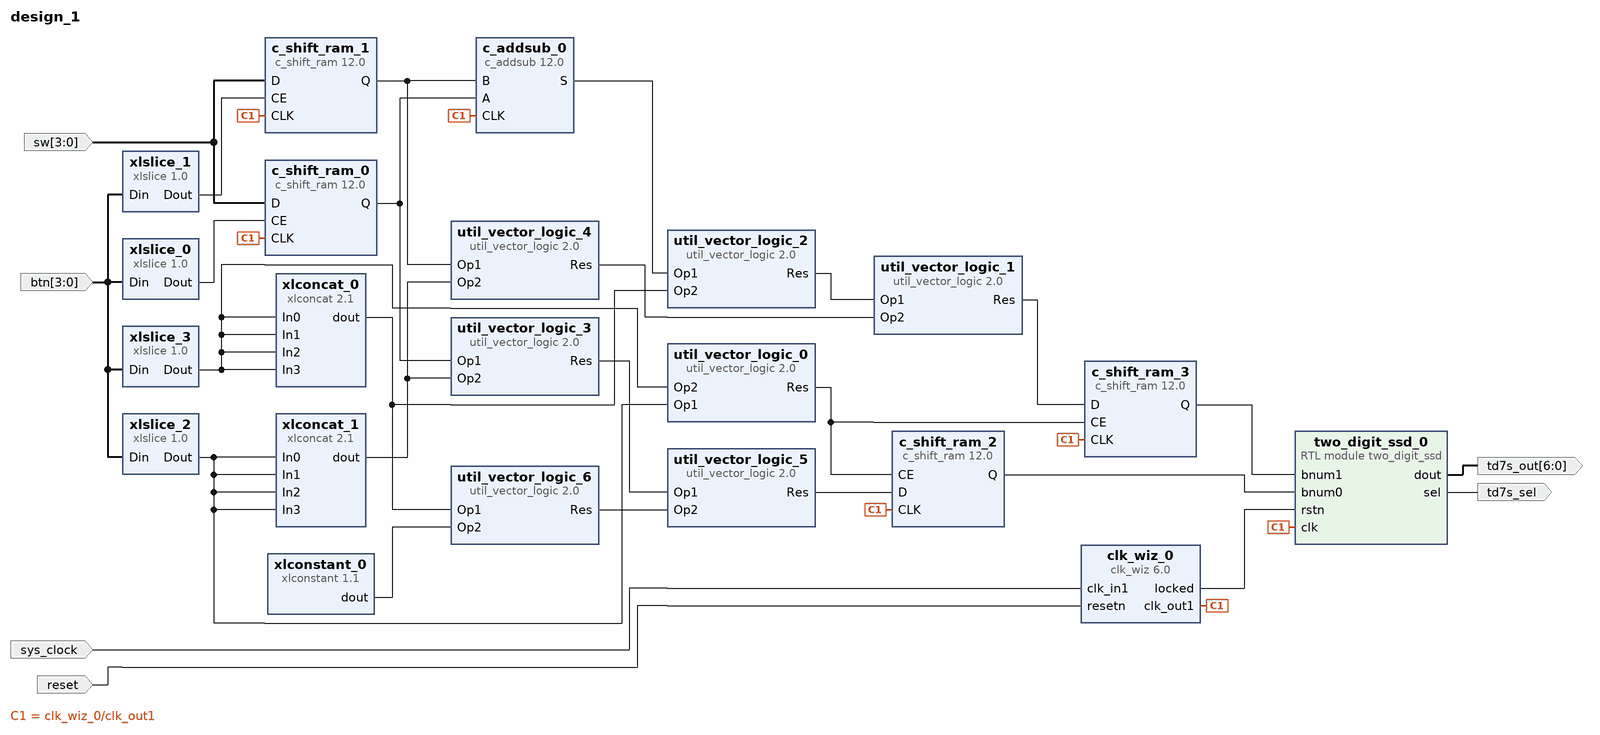
[diagram p0: block diagram of the top level]
# Vivado block design design_1, xc7a35ticsg324-1L, Vivado 2020.2
create_bd_design design_1

create_bd_port -dir I -from 3 -to 0 -type data btn
create_bd_port -dir I -from 3 -to 0 -type data sw
create_bd_port -dir O -type data td7s_sel
create_bd_port -dir O -from 6 -to 0 -type data td7s_out
create_bd_port -dir I -type clk sys_clock
set_property -dict {CONFIG.FREQ_HZ 100000000 CONFIG.PHASE 0.000} [get_bd_ports sys_clock]
create_bd_port -dir I -type rst reset
set_property -dict {CONFIG.POLARITY ACTIVE_LOW} [get_bd_ports reset]

create_bd_cell -type ip -vlnv xilinx.com:ip:clk_wiz:6.0 clk_wiz_0
set_property -dict [list \
  CONFIG.CLK_IN1_BOARD_INTERFACE sys_clock \
  CONFIG.RESET_BOARD_INTERFACE reset \
  CONFIG.RESET_PORT resetn \
  CONFIG.RESET_TYPE ACTIVE_LOW \
  CONFIG.USE_BOARD_FLOW true \
] [get_bd_cells clk_wiz_0]
create_bd_cell -type ip -vlnv xilinx.com:ip:c_shift_ram:12.0 c_shift_ram_0
set_property -dict [list \
  CONFIG.AsyncInitVal 0000 \
  CONFIG.CE true \
  CONFIG.DefaultData 0000 \
  CONFIG.Depth 1 \
  CONFIG.SCLR true \
  CONFIG.SSET true \
  CONFIG.Width 4 \
] [get_bd_cells c_shift_ram_0]
create_bd_cell -type ip -vlnv xilinx.com:ip:xlslice:1.0 xlslice_0
set_property -dict {CONFIG.DIN_WIDTH 4} [get_bd_cells xlslice_0]
create_bd_cell -type ip -vlnv xilinx.com:ip:xlslice:1.0 xlslice_1
set_property -dict {CONFIG.DIN_FROM 1 CONFIG.DIN_TO 1 CONFIG.DIN_WIDTH 4 CONFIG.DOUT_WIDTH 1} [get_bd_cells xlslice_1]
create_bd_cell -type ip -vlnv xilinx.com:ip:xlslice:1.0 xlslice_2
set_property -dict {CONFIG.DIN_FROM 2 CONFIG.DIN_TO 2 CONFIG.DIN_WIDTH 4 CONFIG.DOUT_WIDTH 1} [get_bd_cells xlslice_2]
create_bd_cell -type ip -vlnv xilinx.com:ip:xlslice:1.0 xlslice_3
set_property -dict {CONFIG.DIN_FROM 3 CONFIG.DIN_TO 3 CONFIG.DIN_WIDTH 4 CONFIG.DOUT_WIDTH 1} [get_bd_cells xlslice_3]
create_bd_cell -type ip -vlnv xilinx.com:ip:c_shift_ram:12.0 c_shift_ram_1
set_property -dict [list \
  CONFIG.AsyncInitVal 0000 \
  CONFIG.CE true \
  CONFIG.DefaultData 0000 \
  CONFIG.Depth 1 \
  CONFIG.SCLR true \
  CONFIG.SSET true \
  CONFIG.Width 4 \
] [get_bd_cells c_shift_ram_1]
create_bd_cell -type module -reference two_digit_ssd two_digit_ssd_0
create_bd_cell -type ip -vlnv xilinx.com:ip:c_shift_ram:12.0 c_shift_ram_2
set_property -dict [list \
  CONFIG.AsyncInitVal 0000 \
  CONFIG.CE true \
  CONFIG.DefaultData 0000 \
  CONFIG.Depth 1 \
  CONFIG.SCLR true \
  CONFIG.SSET true \
  CONFIG.Width 4 \
] [get_bd_cells c_shift_ram_2]
create_bd_cell -type ip -vlnv xilinx.com:ip:c_shift_ram:12.0 c_shift_ram_3
set_property -dict [list \
  CONFIG.AsyncInitVal 0000 \
  CONFIG.CE true \
  CONFIG.DefaultData 0000 \
  CONFIG.Depth 1 \
  CONFIG.SCLR true \
  CONFIG.SSET true \
  CONFIG.Width 4 \
] [get_bd_cells c_shift_ram_3]
create_bd_cell -type ip -vlnv xilinx.com:ip:c_addsub:12.0 c_addsub_0
set_property -dict [list \
  CONFIG.A_Type Unsigned \
  CONFIG.A_Width 4 \
  CONFIG.B_Type Unsigned \
  CONFIG.B_Value 0000 \
  CONFIG.B_Width 4 \
  CONFIG.CE false \
  CONFIG.Latency 1 \
  CONFIG.Out_Width 4 \
] [get_bd_cells c_addsub_0]
create_bd_cell -type ip -vlnv xilinx.com:ip:util_vector_logic:2.0 util_vector_logic_0
set_property -dict {CONFIG.C_OPERATION or CONFIG.C_SIZE 1} [get_bd_cells util_vector_logic_0]
create_bd_cell -type ip -vlnv xilinx.com:ip:util_vector_logic:2.0 util_vector_logic_1
set_property -dict {CONFIG.C_OPERATION or CONFIG.C_SIZE 4} [get_bd_cells util_vector_logic_1]
create_bd_cell -type ip -vlnv xilinx.com:ip:util_vector_logic:2.0 util_vector_logic_2
set_property -dict {CONFIG.C_SIZE 4} [get_bd_cells util_vector_logic_2]
create_bd_cell -type ip -vlnv xilinx.com:ip:xlconcat:2.1 xlconcat_0
set_property -dict {CONFIG.NUM_PORTS 4} [get_bd_cells xlconcat_0]
create_bd_cell -type ip -vlnv xilinx.com:ip:xlconcat:2.1 xlconcat_1
set_property -dict {CONFIG.NUM_PORTS 4} [get_bd_cells xlconcat_1]
create_bd_cell -type ip -vlnv xilinx.com:ip:util_vector_logic:2.0 util_vector_logic_3
set_property -dict {CONFIG.C_SIZE 4} [get_bd_cells util_vector_logic_3]
create_bd_cell -type ip -vlnv xilinx.com:ip:util_vector_logic:2.0 util_vector_logic_4
set_property -dict {CONFIG.C_SIZE 4} [get_bd_cells util_vector_logic_4]
create_bd_cell -type ip -vlnv xilinx.com:ip:util_vector_logic:2.0 util_vector_logic_5
set_property -dict {CONFIG.C_OPERATION or CONFIG.C_SIZE 4} [get_bd_cells util_vector_logic_5]
create_bd_cell -type ip -vlnv xilinx.com:ip:util_vector_logic:2.0 util_vector_logic_6
set_property -dict {CONFIG.C_SIZE 4} [get_bd_cells util_vector_logic_6]
create_bd_cell -type ip -vlnv xilinx.com:ip:xlconstant:1.1 xlconstant_0
set_property -dict {CONFIG.CONST_VAL 0 CONFIG.CONST_WIDTH 4} [get_bd_cells xlconstant_0]

# ---- connections ----

connect_bd_net [get_bd_ports btn] [get_bd_pins xlslice_0/Din] [get_bd_pins xlslice_1/Din] [get_bd_pins xlslice_2/Din] [get_bd_pins xlslice_3/Din]
connect_bd_net [get_bd_ports sw] [get_bd_pins c_shift_ram_0/D] [get_bd_pins c_shift_ram_1/D]
connect_bd_net [get_bd_pins clk_wiz_0/clk_out1] \
  [get_bd_pins c_shift_ram_0/CLK] [get_bd_pins c_shift_ram_1/CLK] [get_bd_pins c_shift_ram_3/CLK] \
  [get_bd_pins c_shift_ram_2/CLK] [get_bd_pins two_digit_ssd_0/clk] [get_bd_pins c_addsub_0/CLK]
connect_bd_net [get_bd_pins c_shift_ram_2/Q] [get_bd_pins two_digit_ssd_0/bnum0]
connect_bd_net [get_bd_pins c_shift_ram_3/Q] [get_bd_pins two_digit_ssd_0/bnum1]
connect_bd_net [get_bd_pins clk_wiz_0/locked] [get_bd_pins two_digit_ssd_0/rstn]
connect_bd_net [get_bd_pins two_digit_ssd_0/sel] [get_bd_ports td7s_sel]
connect_bd_net [get_bd_pins two_digit_ssd_0/dout] [get_bd_ports td7s_out]
connect_bd_net [get_bd_ports sys_clock] [get_bd_pins clk_wiz_0/clk_in1]
connect_bd_net [get_bd_ports reset] [get_bd_pins clk_wiz_0/resetn]
connect_bd_net [get_bd_pins xlslice_0/Dout] [get_bd_pins c_shift_ram_0/CE]
connect_bd_net [get_bd_pins xlslice_1/Dout] [get_bd_pins c_shift_ram_1/CE]
connect_bd_net [get_bd_pins c_shift_ram_0/Q] [get_bd_pins c_addsub_0/A] [get_bd_pins util_vector_logic_3/Op1]
connect_bd_net [get_bd_pins c_shift_ram_1/Q] [get_bd_pins c_addsub_0/B] [get_bd_pins util_vector_logic_4/Op1]
connect_bd_net [get_bd_pins xlslice_2/Dout] \
  [get_bd_pins util_vector_logic_0/Op1] [get_bd_pins xlconcat_1/In0] [get_bd_pins xlconcat_1/In1] \
  [get_bd_pins xlconcat_1/In2] [get_bd_pins xlconcat_1/In3]
connect_bd_net [get_bd_pins util_vector_logic_0/Res] [get_bd_pins c_shift_ram_2/CE] [get_bd_pins c_shift_ram_3/CE]
connect_bd_net [get_bd_pins util_vector_logic_1/Res] [get_bd_pins c_shift_ram_3/D]
connect_bd_net [get_bd_pins xlconcat_0/dout] [get_bd_pins util_vector_logic_2/Op2] [get_bd_pins util_vector_logic_6/Op1]
connect_bd_net [get_bd_pins util_vector_logic_2/Res] [get_bd_pins util_vector_logic_1/Op1]
connect_bd_net [get_bd_pins c_addsub_0/S] [get_bd_pins util_vector_logic_2/Op1]
connect_bd_net [get_bd_pins xlconcat_1/dout] [get_bd_pins util_vector_logic_3/Op2] [get_bd_pins util_vector_logic_4/Op2]
connect_bd_net [get_bd_pins util_vector_logic_3/Res] [get_bd_pins util_vector_logic_5/Op1]
connect_bd_net [get_bd_pins xlconstant_0/dout] [get_bd_pins util_vector_logic_6/Op2]
connect_bd_net [get_bd_pins util_vector_logic_6/Res] [get_bd_pins util_vector_logic_5/Op2]
connect_bd_net [get_bd_pins util_vector_logic_4/Res] [get_bd_pins util_vector_logic_1/Op2]
connect_bd_net [get_bd_pins util_vector_logic_5/Res] [get_bd_pins c_shift_ram_2/D]
connect_bd_net [get_bd_pins xlslice_3/Dout] \
  [get_bd_pins xlconcat_0/In0] [get_bd_pins xlconcat_0/In1] [get_bd_pins xlconcat_0/In2] [get_bd_pins xlconcat_0/In3] \
  [get_bd_pins util_vector_logic_0/Op2]

validate_bd_design
save_bd_design
